# EAGLE design PSU (EAGLE 6.1)
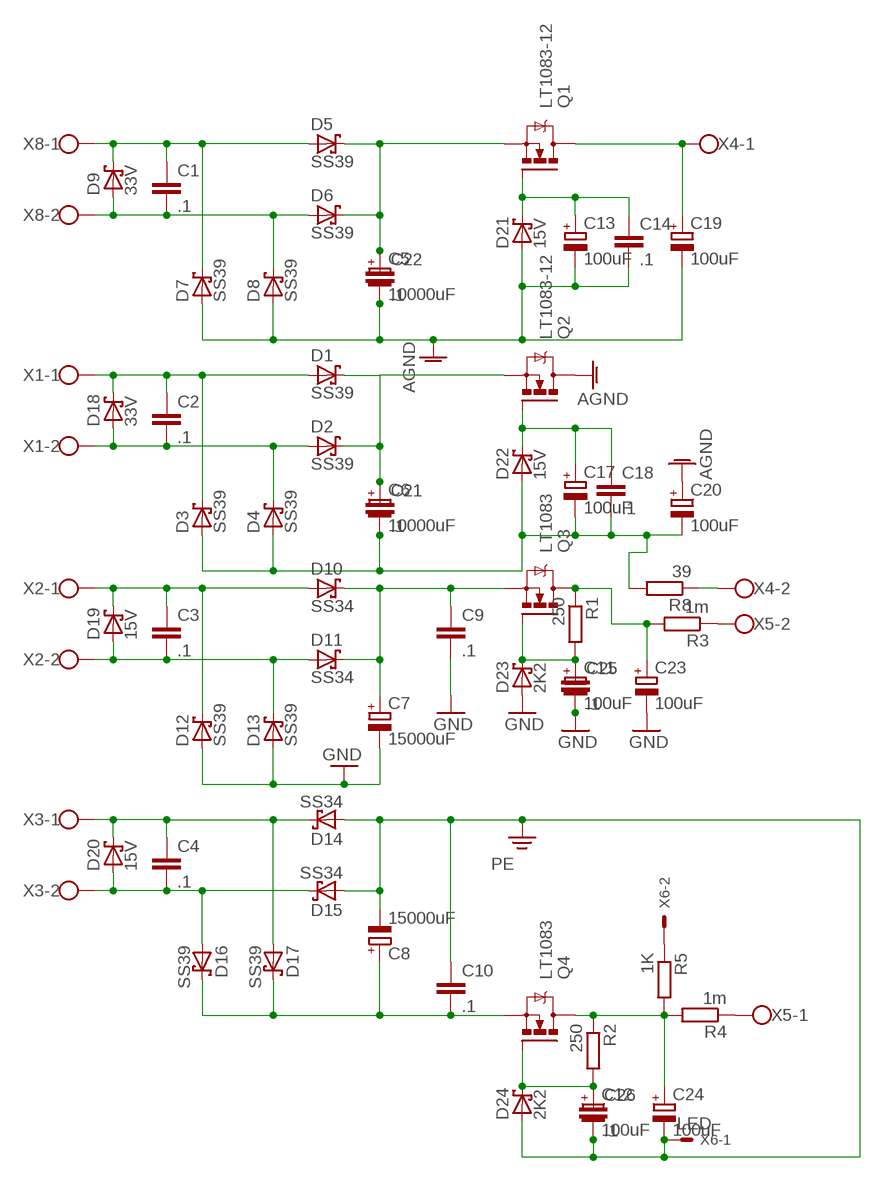
[diagram p0: schematic, sheet 1]

## Parts
C1  .1  C-EU075-042X103  [C075-042X103]
C2  .1  C-EU075-042X103  [C075-042X103]
C3  .1  C-EU075-042X103  [C075-042X103]
C4  .1  C-EU075-042X103  [C075-042X103]
C5  10000uF  CPOL-EUE10-25  [EB25D]
C6  10000uF  CPOL-EUE10-25  [EB25D]
C7  15000uF  CPOL-EUE10-25  [EB25D]
C8  15000uF  CPOL-EUE10-25  [EB25D]
C9  .1  C-EUC1210K  [C1210K]
C10  .1  C-EUC1210K  [C1210K]
C11  100uF  CPOL-EUE5-10.5  [E5-10,5]
C12  100uF  CPOL-EUE5-10.5  [E5-10,5]
C13  100uF  CPOL-EUE5-10.5  [E5-10,5]
C14  .1  C-EUC1210K  [C1210K]
C17  100uF  CPOL-EUE5-10.5  [E5-10,5]
C18  .1  C-EUC1210K  [C1210K]
C19  100uF  CPOL-EUE5-10.5  [E5-10,5]
C20  100uF  CPOL-EUE5-10.5  [E5-10,5]
C21  .1  C-EUC1210K  [C1210K]
C22  .1  C-EUC1210K  [C1210K]
C23  100uF  CPOL-EUE5-10.5  [E5-10,5]
C24  100uF  CPOL-EUE5-10.5  [E5-10,5]
C25  .1  C-EUC1210K  [C1210K]
C26  .1  C-EUC1210K  [C1210K]
D1  SS39  MBRS320T3  [SMC]
D2  SS39  MBRS320T3  [SMC]
D3  SS39  MBRS320T3  [SMC]
D4  SS39  MBRS320T3  [SMC]
D5  SS39  MBRS320T3  [SMC]
D6  SS39  MBRS320T3  [SMC]
D7  SS39  MBRS320T3  [SMC]
D8  SS39  MBRS320T3  [SMC]
D9  33V  MBRS130LT3  [SMB]
D10  SS34  MBRS320T3  [SMC]
D11  SS34  MBRS320T3  [SMC]
D12  SS39  MBRS320T3  [SMC]
D13  SS39  MBRS320T3  [SMC]
D14  SS34  MBRS320T3  [SMC]
D15  SS34  MBRS320T3  [SMC]
D16  SS39  MBRS320T3  [SMC]
D17  SS39  MBRS320T3  [SMC]
D18  33V  MBRS130LT3  [SMB]
D19  15V  MBRS130LT3  [SMB]
D20  15V  MBRS130LT3  [SMB]
D21  15V  MBRS130LT3  [SMB]
D22  15V  MBRS130LT3  [SMB]
D23  2K2  MBRS130LT3  [SMB]
D24  2K2  MBRS130LT3  [SMB]
Q1  LT1083-12  IXFH_6N90  [TO-247AD-H]
Q2  LT1083-12  IXFH_6N90  [TO-247AD-H]
Q3  LT1083  IXFH_6N90  [TO-247AD-H]
Q4  LT1083  IXFH_6N90  [TO-247AD-H]
R1  250  R-EU_R1210  [R1210]
R2  250  R-EU_R1210  [R1210]
R3  1m  R-EU_0309/12  [0309/12]
R4  1m  R-EU_0309/12  [0309/12]
R5  1K  R-EU_R1210  [R1210]
R8  39  R-EU_0309/12  [0309/12]
X1  W237-102  [W237-102]
X2  W237-102  [W237-102]
X3  W237-102  [W237-102]
X4  W237-102  [W237-102]
X5  W237-102  [W237-102]
X6  LED  22-23-2021  [22-23-2021]
X8  W237-102  [W237-102]

## Nets
AGND: C5.- C13.- C14.2 C19.- C20.+ C22.2 D7.A D8.A D21.A Q2.D
FGD: C7.- C9.2 C11.- C23.- C25.2 D12.A D13.A D23.A ; supply symbol labelled GND
N$1: C2.1 D1.A D3.C D18.C X1.1
N$2: C2.2 D2.A D4.C D18.A X1.2
N$3: C17.+ C18.1 D22.C Q2.G
N$4: C13.+ C14.1 D21.C Q1.G
N$5: C3.1 D10.A D12.C D19.C X2.1
N$6: C3.2 D11.A D13.C D19.A X2.2
N$7: C8.+ C10.2 D16.C D17.C Q4.S
N$8: C7.+ C9.1 D10.C D11.C Q3.S
N$9: C4.1 D14.C D17.A D20.C X3.1
N$10: C4.2 D15.C D16.A D20.A X3.2
N$11: C23.+ Q3.D R1.1 R3.2
N$12: C6.+ C21.1 D1.C D2.C Q2.S
N$13: C19.+ Q1.D X4.1
N$14: C11.+ C25.1 D23.C Q3.G R1.2
N$15: R8.1 X4.2
N$16: C12.+ C26.1 D24.C Q4.G R2.2
N$17: C24.+ Q4.D R2.1 R4.2 R5.2
N$18: R3.1 X5.2
N$19: C1.1 D5.A D7.C D9.C X8.1
N$20: C1.2 D6.A D8.C D9.A X8.2
N$21: R4.1 X5.1
N$22: C5.+ C22.1 D5.C D6.C Q1.S
N$23: R5.1 X6.2
N$25: C6.- C17.- C18.2 C20.- C21.2 D3.A D4.A D22.A R8.2
PE: C8.- C10.1 C12.- C24.- C26.2 D14.A D15.A D24.A X6.1

## Library data of the parts
C1-C4 C9 C10 C14 C18 C21 C22 C25 C26 = resistor:C-EU: CAPACITOR, European symbol
C5-C8 C11-C13 C17 C19 C20 C23 C24 = resistor:CPOL-EU: POLARIZED CAPACITOR, European symbol
D1-D8 D10-D17 = diode:MBRS3*0T3: SCHOTTKY BARRIER RECTIFIER 3.0 AMPERES 20, 30, 40 VOLT Source: MBRS340T3-D.pdf
D9 D18-D24 = diode:MBRS130LT3: Schottky Power Rectifier Source: http://www.onsemi.com/pub/Collateral/MBRS130LT3-D.PDF
Q1-Q4 = transistor-power:IXF?6N*: HiPerFET (TM) Power MOSFET N-Channel Enhancement Mode HDMOS Family Source: http://www.ixys.com/91529.pdf
R1-R5 R8 = resistor:R-EU_: RESISTOR, European symbol
X1-X5 X8 = con-wago-500:W237-102: WAGO SCREW CLAMP; MPN: 237-102; OC_FARNELL: unknown; OC_NEWARK: 70K9898
X6 = con-molex:22-23-2021: .100" (2.54mm) Center Header - 2 Pin; MF: MOLEX; MPN: 22-23-2021; OC_FARNELL: 1462926; OC_NEWARK: 25C3832

## Board
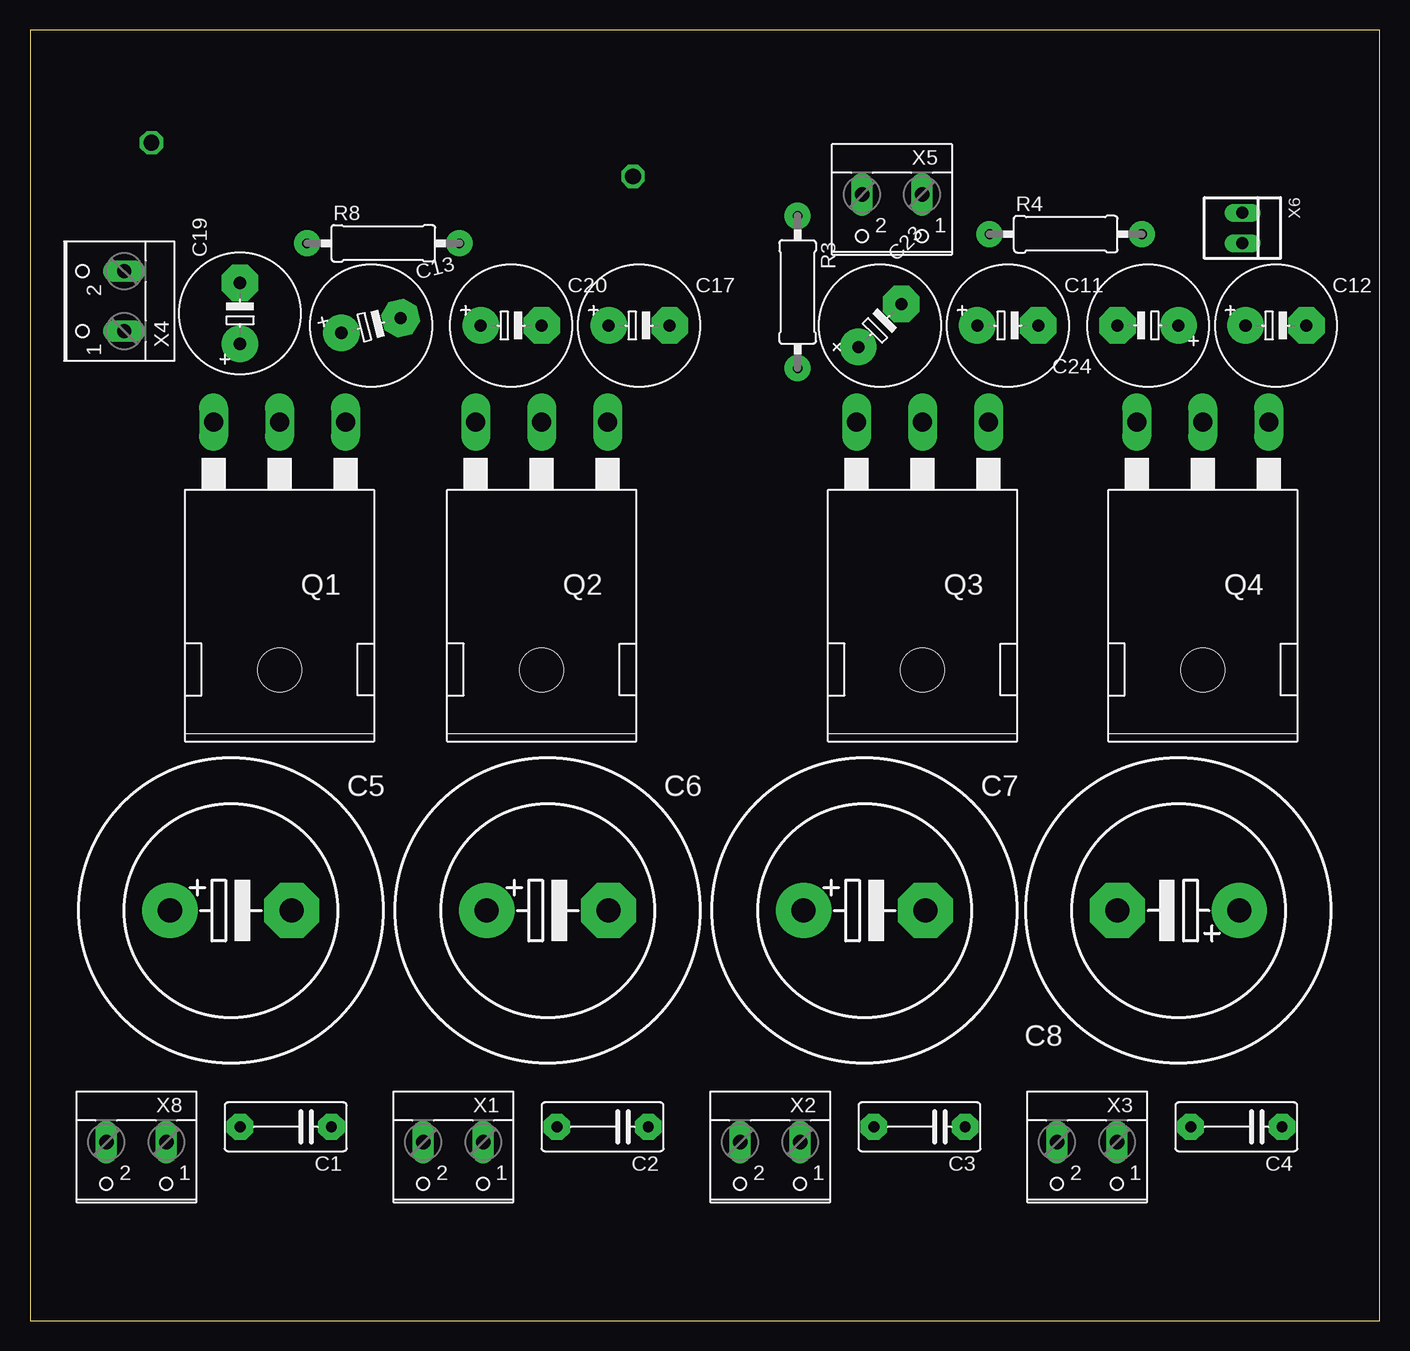
[diagram p1: board, top side]
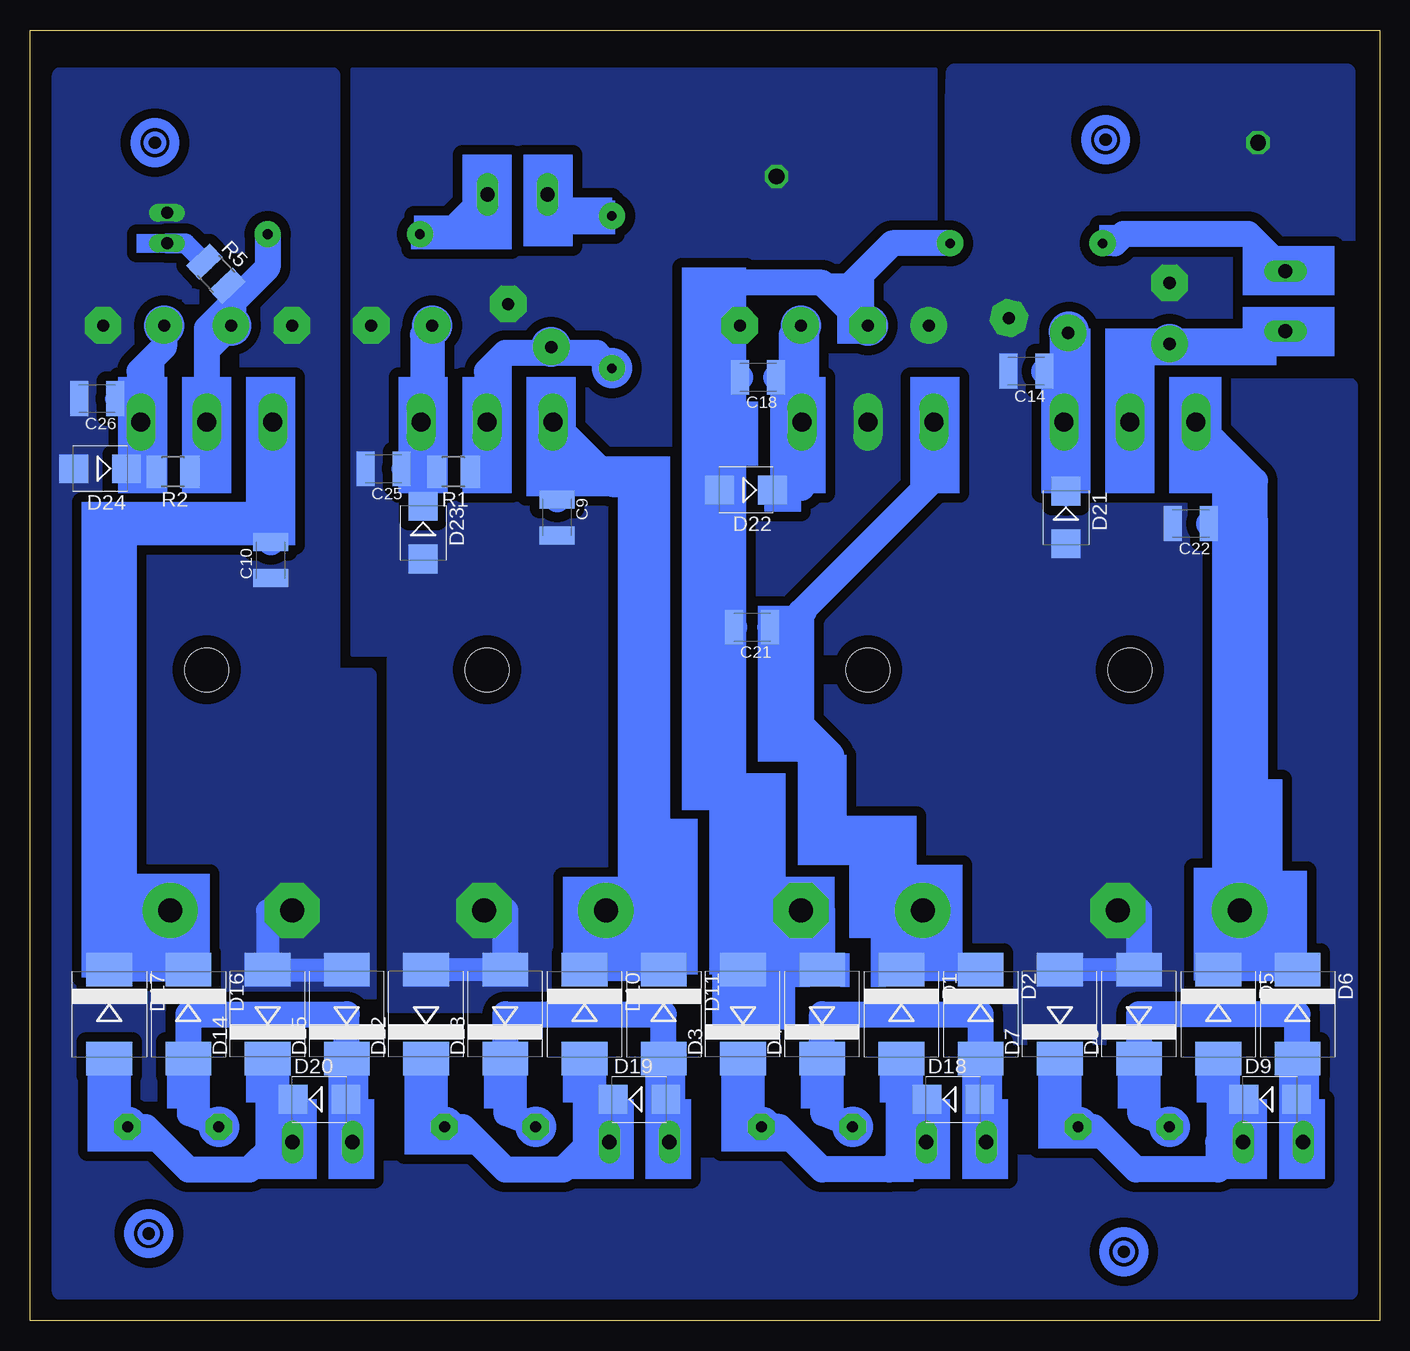
[diagram p2: board, bottom side, seen from below]

Size 112.5 x 107.62 mm. Coordinates in mm from the lower left corner, seen from the top.
Outline: 112.5,107.62 0,107.62 0,0 112.5,0 112.5,107.62
Copper layers (1*16): Top 0.035mm / dielectric 1.5mm / Bottom 0.035mm
Design rules: minimum track width 10mil, minimum drill 24mil, track to track 8mil, track to pad 8mil, pad to pad 8mil, via to via 8mil, smd to smd 8mil, copper to edge 40mil, drill to drill 8mil, minimum pad ring 10mil, minimum via ring 8mil, stop-mask expansion 4mil, vias tented up to drill 0mil, thermal gap 10mil

### Footprints (pad centres in the part's own frame; a part is rotated, then mirrored left to right if it is on the bottom)
C075-042X103 = drill 0.914 pad 2.184 octagon: 1 -3.81,0; 2 3.81,0
EB25D = drill 2.007 pad 4.597: + -5.08,0 | drill 2.007 pad 4.597 octagon: - 5.08,0
C1210K = smd 1.5 x 2.9: 1 -1.5,0; 2 1.5,0
E5-10,5 = drill 1.016 pad 3.048: + -2.54,0 | drill 1.016 pad 3.048 octagon: - 2.54,0
SMC = smd 2.8 x 3.8: A 3.7,0; C -3.7,0
SMB = smd 2.4 x 2.4: A 2.2,0; C -2.2,0
TO-247AD-H = drill 1.6 long: D 0,-20.65; G -5.5,-20.65; S 5.5,-20.65 | hole 3.65: 0,0
R1210 = smd 1.6 x 2.7: 1 -1.4,0; 2 1.4,0
0309/12 = drill 0.8 pad 2.184: 1 -6.35,0; 2 6.35,0
W237-102 = drill 1.194 long: 1 -2.5,-1.27; 2 2.5,-1.27
22-23-2021 = drill 1 long: 1 -1.27,0; 2 1.27,0

### Placement (x,y rotation side)
C1  21.32,16.18 180 top
C2  47.73,16.18 180 top
C3  74.15,16.18 180 top
C4  100.56,16.18 180 top
C5  16.74,34.21 0 top
C6  43.16,34.21 0 top
C7  69.58,34.21 0 top
C8  95.74,34.21 180 top
C9  68.56,66.98 270 bottom
C10  92.44,63.42 90 bottom
C11  81.51,82.98 0 top
C12  103.87,82.98 0 top
C13  28.43,82.98 14.1 top
C14  29.44,79.17 180 bottom
C17  50.78,82.98 0 top
C18  51.8,78.66 180 bottom
C19  17.51,84 90 top
C20  40.11,82.98 0 top
C21  52.3,57.84 180 bottom
C22  15.73,66.47 180 bottom
C23  70.85,82.98 45 top
C24  93.2,82.98 180 top
C25  83.04,71.04 180 bottom
C26  106.91,76.89 180 bottom
D1  39.86,25.58 270 bottom
D2  33.25,25.58 270 bottom
D3  53.07,25.58 90 bottom
D4  46.46,25.58 90 bottom
D5  13.44,25.58 270 bottom
D6  6.84,25.58 270 bottom
D7  26.65,25.58 90 bottom
D8  20.05,25.58 90 bottom
D9  9.12,18.47 0 bottom
D10  66.27,25.58 270 bottom
D11  59.67,25.58 270 bottom
D12  79.48,25.58 90 bottom
D13  72.88,25.58 90 bottom
D14  92.69,25.58 90 bottom
D15  86.09,25.58 90 bottom
D16  99.29,25.58 270 bottom
D17  105.9,25.58 270 bottom
D18  35.54,18.47 0 bottom
D19  61.7,18.47 0 bottom
D20  88.37,18.47 0 bottom
D21  26.14,66.98 270 bottom
D22  52.81,69.27 180 bottom
D23  79.74,65.71 270 bottom
D24  106.66,71.04 180 bottom
Q1  20.81,54.28 180 top
Q2  42.65,54.28 180 top
Q3  74.4,54.28 180 top
Q4  97.77,54.28 180 top
R1  77.2,70.79 180 bottom
R2  100.56,70.79 180 bottom
R3  63.99,85.78 270 top
R4  86.34,90.6 0 top
R5  97.01,87.3 313.4 bottom
R8  29.44,89.84 0 top
X1  35.29,13.64 180 top
X2  61.7,13.64 180 top
X3  88.12,13.64 180 top
X4  6.58,85.01 90 top
X5  71.86,92.63 180 top
X6  101.07,91.11 270 top
X8  8.87,13.64 180 top

### Tracks (layer width: path | path; a pad name or v marks a point on that pad's centre or on a via)
AGND  (via drill 1.3 pad 1.68)
  Bottom 1.93: D8.A D7.A
  Bottom 2.184: C5.- 20.05,34.21 D8.A
  other vias: 10.14,98.22
  pour Bottom (isolate 0.813, no thermals): 2.72,23.67 57.28,23.67 56.88,69.01 56.88,89.08 35.54,89.08 35.54,101.6 35.44,104.14 2.72,104.14
FGD  (via drill 1.3)
  Bottom 1.93: D13.A D12.A
  Bottom 2.184: C7.- 72.88,34.21 D13.A
  other vias: 50.27,95.43
  pour Bottom (isolate 0.813, no thermals): 85.58,104.32 37.06,104.32 37.06,25.83 82.53,25.83 82.53,55.55 85.58,55.55
N$1
  Bottom 0.406: D18.C 39.86,20.75 39.86,20.5
  Bottom 1.93: X1.1 39.86,14.91 39.86,20.5 D1.A | D3.C 53.07,15.93 C2.1
  Bottom 2.184: 39.86,14.91 39.6,14.66 39.6,13.89 40.87,12.62 46.46,12.62 50.02,16.18 C2.1 51.8,16.18
N$2
  Bottom 0.406: D18.A 32.75,20.75 32.75,20.5
  Bottom 1.93: X1.2 32.75,14.91 32.75,20.5 32.75,21.77 33,21.77 33,22.02 33.25,22.02 D2.A | C2.2 46.46,17.2 D4.C
  Bottom 2.184: D4.C 46.46,25.58 33.25,25.58 D2.A
N$3
  Bottom 2.184: D22.C 48.15,69.44 Q2.G 48.82,74.93 49,75.11 49,78.92 | C17.+ 49,82.22 49,78.92 | C18.1 50.04,78.92 49,78.92
N$4
  Bottom 2.184: 26.4,79.68 26.4,75.02 Q1.G 26.65,74.59 26.65,70.54 26.14,70.03 D21.C 26.14,69.01 | 26.4,79.68 26.4,82.22 C13.+ | C14.1 26.93,79.68 26.4,79.68
N$5
  Bottom 0.406: D19.C 66.27,20.75
  Bottom 1.93: X2.1 64.24,14.91 66.27,14.91 66.27,20.75 D10.A | D12.C 79.48,15.93 C3.1
  Bottom 2.184: C3.1 76.43,16.18 72.88,12.62 68.05,12.62 65.26,15.42 65,15.42 64.5,14.91 64.24,14.91
N$6
  Bottom 0.406: D19.A 59.16,20.75 59.16,16.18
  Bottom 1.93: X2.2 59.16,14.91 59.16,16.18 59.16,21.77 59.42,21.77 59.42,22.02 59.67,22.02 D11.A | C3.2 72.88,17.2 D13.C
  Bottom 2.184: 59.67,22.02 59.67,25.58 72.88,25.58 D13.C
N$7
  Bottom 1.93: D17.C D16.C 99.29,34.21 C8.+ 101.07,33.96 102.09,33.96 105.14,37.01 105.14,52.5 105.64,53.01
  Bottom 2.184: Q4.S 92.44,74.76 92.44,66.98 92.44,66.22 | 92.44,66.22 105.39,66.22 105.64,65.96 105.64,53.01 | C10.2 92.44,66.22
N$8
  Bottom 1.93: D11.C D10.C | 64.75,34.21 64.5,34.47 C7.+
  Bottom 2.184: D10.C 66.27,34.21 64.75,34.21 C7.+ 62.21,34.21 61.19,35.23 61.19,44.37 61.45,44.63 61.45,69.52 61.19,69.77 63.73,69.77 63.75,69.77 | Q3.S 63.75,69.77 | C9.1 68.81,68.73 68.81,74.6 63.99,69.77 63.75,69.77
N$9
  Bottom 0.406: D20.C 92.69,20.75 92.69,19.48 92.69,16.43
  Bottom 1.93: X3.1 92.18,14.91 92.69,14.91 92.69,16.43 | 105.9,15.93 C4.1 105.9,16.18 D17.A | D14.C 92.69,19.48
  Bottom 2.184: C4.1 102.85,16.18 99.29,12.62 94.21,12.62 92.18,14.66 92.18,14.91
N$10
  Bottom 0.406: D20.A 85.58,20.75 85.58,19.74
  Bottom 1.93: X3.2 85.58,14.91 85.58,19.74 85.58,21.77 85.83,21.77 85.83,21.88 | 86.09,22.02 85.83,22.02 85.83,21.88 | C4.2 99.29,17.2 99.29,17.45 | 99.29,17.45 99.04,17.45 99.04,22.02 99.29,22.02 D16.A 99.29,17.45 | D15.C 85.83,21.88
  Bottom 2.184: 86.09,22.02 86.09,25.58 99.29,25.58 D16.A
N$11
  Bottom 1.422: R1.1 74.4,72.18 74.4,74.85 Q3.D
  Bottom 2.184: C23.+ 69.54,80.7 | 69.54,80.7 72.88,80.7 74.4,79.17 74.4,74.85 | R3.2 65.26,80.7 69.07,80.7 | 69.07,80.7 69.54,80.7 | 69.07,80.7 69.07,81.2
N$12
  Bottom 1.93: D2.C D1.C | C6.+ 39.1,34.21
  Bottom 2.184: Q2.S 37.15,70.19 48.24,59.11 48.24,58.85 | 48.24,58.34 48.24,49.71 45.7,47.17 45.7,40.31 45.45,40.06 41.13,40.06 40.87,39.8 40.87,37.01 38.46,34.59 | C21.1 50.55,58.09 48.49,58.09 48.24,58.34 | 47.99,59.11 48.24,58.85 | 48.24,58.85 48.24,58.34 | 38.46,34.59 C6.+ | D1.C 39.86,34.47 38.59,34.47 38.46,34.59
N$13
  Bottom 2.184: 20.55,81.46 20.81,81.46 20.81,81.2 | 20.81,74.85 Q1.D 20.81,81.2 | X4.1 8.91,81.46 C19.+ 20.55,81.46 | 20.55,81.46 20.81,81.2
N$14
  Bottom 1.422: Q3.G 79.9,72.1 R1.2 79.61,71.81 79.74,71.81 | D23.C 79.74,68 79.74,71.81 | 79.74,71.81 79.74,74.85
  Bottom 1.676: C25.1 79.23,71.04 79.74,70.54 79.74,68
  Bottom 2.184: C11.+ 79.74,82.22 79.74,74.85
N$15
  Bottom 2.184: X4.2 10.94,90.6 21.32,90.6 22.08,89.84 R8.1
N$16
  Bottom 1.422: R2.2 103.27,72.1 Q4.G 103.27,71.72 102.85,71.3 104.21,71.3 D24.C
  Bottom 1.676: C26.1 105.16,76.63 103.36,76.63
  Bottom 2.184: C12.+ 101.33,81.2 103.36,79.17 103.36,76.63 103.36,74.6 103.1,74.6 103.1,74.85 103.19,74.85 Q4.G
N$17
  Bottom 1.422: R2.1 97.77,72.18 Q4.D 97.77,75.11
  Bottom 1.676: R5.2 95.28,85.52 94.98,85.52
  Bottom 2.184: C24.+ 97.77,80.95 | 97.77,80.95 Q4.D | R4.2 92.69,87.81 94.98,85.52 97.77,82.73 97.77,80.95
N$18
  Bottom 2.184: X5.2 67.58,92.13 R3.1
N$19
  Bottom 0.406: D9.C 13.44,20.75 13.44,20.5
  Bottom 1.93: X8.1 13.44,14.91 13.44,20.5 D5.A | D7.C 26.65,15.93 C1.1
  Bottom 2.184: 13.44,14.91 13.44,12.62 20.3,12.62 23.86,16.18 C1.1
N$20
  Bottom 0.406: D9.A 6.33,20.75
  Bottom 1.93: X8.2 6.33,14.91 6.33,20.75 6.33,21.77 6.58,21.77 6.58,22.02 6.84,22.02 D6.A | C1.2 20.05,17.2 D8.C
  Bottom 2.184: 6.84,22.02 6.84,25.58 20.05,25.58 D8.C
N$21
  Bottom 2.184: X5.1 77.66,90.6 R4.1
N$22
  Bottom 1.93: D6.C D5.C | 10.39,43.1 11.41,43.1 12.93,53.52 12.93,50.98 | 12.93,50.98 12.93,36.75 12.43,36.25 12.43,34.98 C5.+ | 12.68,51.23 12.93,50.98
  Bottom 2.184: C5.+ 13.44,34.21 D5.C | Q1.S 10.39,70.02 | 10.39,66.73 10.39,43.1 | C22.1 13.97,66.73 10.39,66.73 | 10.39,66.73 10.39,70.02 | 10.39,70.02 10.39,70.03
N$23
  Bottom 1.676: X6.2 99.55,89.84 98.02,88.32 R5.1
N$25
  Bottom 1.93: D4.A D3.A | C6.- 46.46,34.21
  Bottom 2.184: 46.46,34.21 D4.A | C17.- 53.83,82.47 | 53.83,82.47 55.1,81.2 55.1,78.92 | 55.1,78.92 55.1,69.77 54.59,69.27 | 54.59,69.27 D22.A | C18.2 53.55,78.92 55.1,78.92 | 44.94,85.01 46.46,86.54 54.08,86.54 54.34,86.03 54.34,82.73 54.08,82.47 53.83,82.47 | R8.2 40.62,89.84 44.94,85.52 44.94,85.01 | 44.94,85.01 42.91,82.98 C20.- | 54.59,69.27 54.59,58.62 C21.2 54.34,57.84 55.35,56.82 55.35,45.39 54.59,44.63 53.83,44.63 51.54,42.34 51.54,37.52 C6.-
PE
  Bottom 1.93: C8.- 92.69,34.21 D14.A D15.A
  pour Bottom (isolate 0.813, no thermals): 87.36,103.81 87.36,53.77 84.31,53.77 84.31,25.58 81.01,25.58 14.71,24.05 14.71,77.9 2.52,77.9 2.52,2.46 109.96,2.46 109.96,103.81
(copper drawn outside any net)
  shapes: Bottom area x147, Bottom circle x29